# Altium schematic sheet zs-pentagon-dip_1.SchDoc
size A4
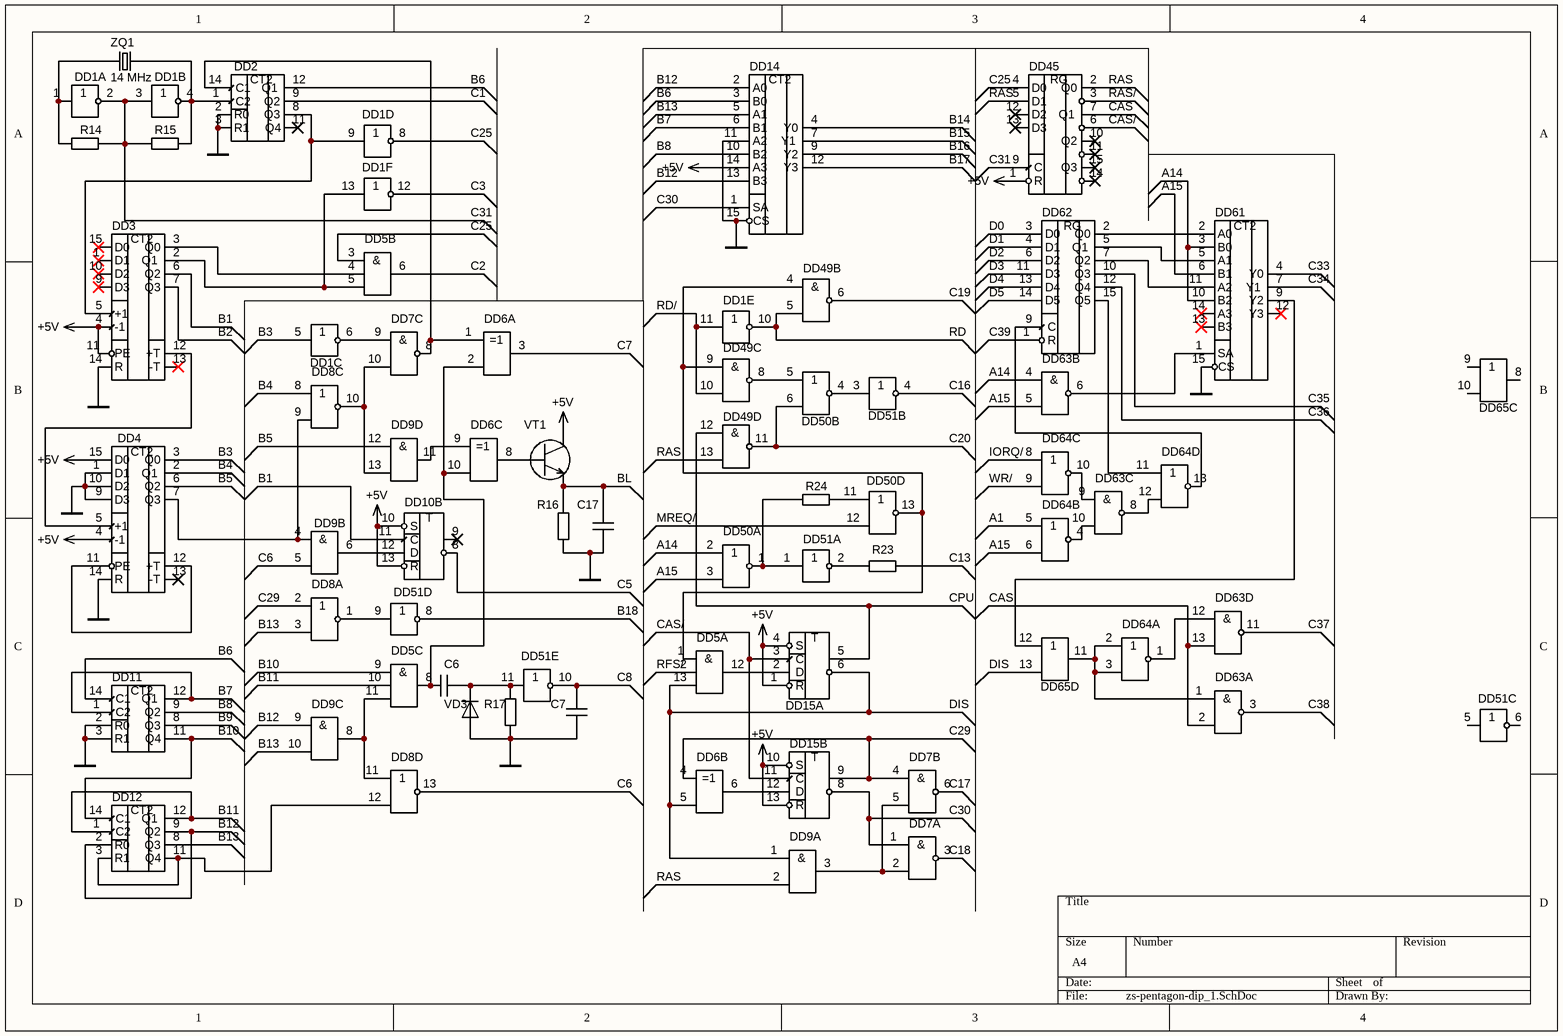
[diagram p0: zs-pentagon-dip_1.SchDoc]

## Parts
C6  0.022 мкФ  [C0805]  (value not drawn)
C7  510 пФ  [C0805]  (value not drawn)
C17  1200 пФ  [C0805]  (value not drawn)
DD1  КР1533ЛН1  [DIP14]  (value not drawn)  (parts A,B,C,D,E,F of 6)
DD2  КР1533ИЕ5  [DIP14]  (value not drawn)
DD3  КР1533ИЕ7  [DIP16]  (value not drawn)
DD4  КР1533ИЕ7  [DIP16]  (value not drawn)
DD5  КР1533ЛИ3  [DIP14]  (value not drawn)  (parts A,B,C of 3)
DD6  КР1533ЛП5  [DIP14]  (value not drawn)  (parts A,B,C of 4)
DD7  КР1533ЛA3  [DIP14]  (value not drawn)  (parts A,B,C of 4)
DD8  КР1533ЛЕ1  [DIP14]  (value not drawn)  (parts A,C,D of 4)
DD9  КР1533ЛИ1  [DIP14]  (value not drawn)  (parts A,B,C,D of 4)
DD10  КР1533ТМ2  [DIP14]  (value not drawn)  (part B of 2)
DD11  КР1533ИЕ5  [DIP14]  (value not drawn)
DD12  КР1533ИЕ5  [DIP14]  (value not drawn)
DD14  КР1533КП11А  [DIP16]  (value not drawn)
DD15  КР1533ТМ2  [DIP14]  (value not drawn)  (parts A,B of 2)
DD45  КР1533ТМ8  [DIP16]  (value not drawn)
DD49  КР1533ЛA3  [DIP14]  (value not drawn)  (parts B,C,D of 4)
DD50  КР1533ЛЕ1  [DIP14]  (value not drawn)  (parts A,B,D of 4)
DD51  КР1533ЛН1  [DIP14]  (value not drawn)  (parts A,B,C,D,E of 6)
DD61  КР1533КП11А  [DIP16]  (value not drawn)
DD62  КР1533ТМ9  [DIP16]  (value not drawn)
DD63  КР1533ЛA3  [DIP14]  (value not drawn)  (parts A,B,C,D of 4)
DD64  КР1533ЛЕ1  [DIP14]  (value not drawn)  (parts A,B,C,D of 4)
DD65  КР1533ЛЛ1  [DIP14]  (value not drawn)  (parts C,D of 4)
R14  510 Ом  [R0603]  (value not drawn)
R15  510 Ом  [R0603]  (value not drawn)
R16  160 Ом  [R0603]  (value not drawn)
R17  1 кОм  [R0603]  (value not drawn)
R23  470 Ом  [R0603]  (value not drawn)
R24  470 Ом  [R0603]  (value not drawn)
VD3  1N4148W  [SODFL1608X70N]  (value not drawn)
VT1  КТ315Б  [KT-13]  (value not drawn)
ZQ1  14 MHz  [XTAL_HC-49U]

## Nets
+5V: DD3.4(-1) DD3.11(PE) DD4.4(-1) DD4.15(D0) DD10.10(S) DD10.13(R) DD14.14(A3) DD15.1(R) DD15.4(S) DD15.10(S) DD15.13(R) DD45.1(R) VT1.2(C)
GND: C7.2 C17.1 DD1.7(GND) DD2.2(R0) DD2.3(R1) DD2.10(GND) DD3.8(GND) DD3.14(R) DD4.1(D1) DD4.8(GND) DD4.9(D3) DD4.10(D2) DD4.14(R) DD5.7(GND) DD6.7(GND) DD7.7(GND) DD8.7(GND) DD9.7(GND) DD11.2(R0) DD11.3(R1) DD11.10(GND) DD12.10(GND) DD14.8(GND) DD14.11(A2) DD14.15(CS) DD15.7(GND) DD45.8(GND) DD50.7(GND) DD51.7(GND) DD61.8(GND) DD61.15(CS) DD62.8(GND) DD63.7(GND) DD64.7(GND) R16.1 R17.1 VD3.A
VCC: DD1.14(VCC) DD2.5(VCC) DD3.16(VCC) DD4.16(VCC) DD5.14(VCC) DD6.14(VCC) DD7.14(VCC) DD8.14(VCC) DD9.14(VCC) DD11.5(VCC) DD12.5(VCC) DD14.16(VCC) DD15.14(VCC) DD45.16(VCC) DD50.14(VCC) DD51.14(VCC) DD61.16(VCC) DD62.16(VCC) DD63.14(VCC) DD64.14(VCC)
A1: DD64.5
A14: DD50.2 DD61.3(B0) DD61.10(B2) DD63.4
A15: DD50.3 DD61.6(B1) DD63.5 DD64.6
B1: DD3.6(Q2) DD10.11(C)
B2: DD3.7(Q3)
B3: DD1.5 DD4.3(Q0)
B4: DD4.2(Q1) DD8.8
B5: DD4.6(Q2) DD9.12
B6: DD2.12(Q1) DD11.14(C1) DD14.3(B0)
B7: DD11.1(C2) DD11.12(Q1) DD14.6(B1)
B8: DD11.9(Q2) DD14.10(B2)
B9: DD11.8(Q3)
B10: DD5.9 DD11.11(Q4) DD12.14(C1)
B11: DD5.10 DD12.1(C2) DD12.12(Q1)
B12: DD9.9 DD12.2(R0) DD12.9(Q2) DD14.2(A0) DD14.13(B3)
B13: DD8.3 DD9.10 DD12.8(Q3) DD14.5(A1)
B14: DD14.4(Y0)
B15: DD14.7(Y1)
B16: DD14.9(Y2)
B17: DD14.12(Y3)
B18: DD51.8
BL: C17.2 R16.2 VT1.1(E)
C1: DD2.9(Q2)
C2: DD5.6
C3: DD1.12
C5: DD10.8
C6: DD8.13 DD9.5
C7: DD6.3
C8: C7.1 DD51.10
C13: R23.1
C16: DD51.4
C17: DD7.6
C18: DD7.3
C19: DD49.6
C20: DD49.11 DD50.6
C25: DD1.8 DD5.3 DD45.4(D0)
C29: DD6.4 DD7.4 DD8.2 DD15.9
C30: DD7.1 DD14.1(SA) DD15.8
C31: DD1.2 DD1.3 DD45.9(C) R14.2 R15.1
C33: DD61.4(Y0)
C34: DD61.7(Y1)
C35: DD62.10(Q3)
C36: DD62.12(Q4)
C37: DD63.11
C38: DD63.3
C39: DD62.1(R)
CAS: DD45.7(Q1) DD63.2 DD63.13
CAS/: DD15.3(C) DD15.11(C) DD45.6
CPU: DD15.5 DD49.12
D0: DD62.3(D0)
D1: DD62.4(D1)
D2: DD62.6(D2)
D3: DD62.11(D3)
D4: DD62.13(D4)
D5: DD62.14(D5)
DIS: DD5.13 DD6.5 DD9.1 DD15.6 DD65.13
IORQ/: DD64.8
MREQ/: DD50.12
RAS: DD9.2 DD45.2(Q0) DD45.5(D1) DD49.13
RAS/: DD45.3
RD: DD1.10 DD49.5
RD/: DD1.11 DD49.10
RFS/: DD5.2
WR/: DD64.9
NetC6_1: C6.1 DD51.11 R17.2 VD3.C
NetC6_2: C6.2 DD5.8 DD6.2 DD6.10
NetDD1_1: DD1.1 R14.1 ZQ1.2
NetDD1_4: DD1.4 DD2.1(C2) R15.2 ZQ1.1
NetDD1_6: DD1.6 DD7.9
NetDD1_9: DD1.9 DD2.8(Q3) DD3.5(+1)
NetDD1_13: DD1.13 DD3.2(Q1) DD5.5
NetDD2_14: DD2.14(C1) DD6.1 DD7.8
NetDD3_3: DD3.3(Q0) DD5.4
NetDD3_12: DD3.12(+T) DD4.5(+1)
NetDD4_7: DD4.7(Q3) DD8.9 DD9.4
NetDD4_11: DD4.11(PE) DD4.12(+T)
NetDD5_1: DD5.1 DD49.4 DD49.9 DD50.13
NetDD5_11: DD5.11 DD8.11 DD9.8
NetDD5_12: DD5.12 DD15.2(D)
NetDD6_6: DD6.6 DD15.12(D)
NetDD6_8: DD6.8 VT1.3(B)
NetDD6_9: DD6.9 DD9.11
NetDD7_2: DD7.2 DD7.5 DD9.3
NetDD7_10: DD7.10 DD8.10 DD9.13
NetDD8_1: DD8.1 DD51.9
NetDD8_12: DD8.12 DD12.3(R1) DD12.11(Q4)
NetDD9_6: DD9.6 DD10.12(D)
NetDD49_8: DD49.8 DD50.5
NetDD50_1: DD50.1 DD51.1 R24.2
NetDD50_4: DD50.4 DD51.3
NetDD50_11: DD50.11 R24.1
NetDD51_2: DD51.2 R23.2
NetDD61_1: DD61.1(SA) DD63.6
NetDD61_2: DD61.2(A0) DD62.2(Q0)
NetDD61_5: DD61.5(A1) DD62.5(Q1)
NetDD61_9: DD61.9(Y2) DD65.12
NetDD61_11: DD61.11(A2) DD62.7(Q2)
NetDD62_9: DD62.9(C) DD64.13
NetDD62_15: DD62.15(Q5) DD64.11
NetDD63_1: DD63.1 DD64.2 DD64.3 DD65.11
NetDD63_8: DD63.8 DD64.12
NetDD63_9: DD63.9 DD64.10
NetDD63_10: DD63.10 DD64.4
NetDD63_12: DD63.12 DD64.1

Not connected (* = marked no-connect by the designer): DD2 11(Q4)*; DD3 1(D1)* 9(D3)* 10(D2)* 13(-T)* 15(D0)*; DD4 13(-T)*; DD10 9*; DD45 10(Q2)* 11* 12(D2)* 13(D3)* 14* 15(Q3)*; DD51 5 6; DD61 12(Y3)* 13(B3)* 14(A3)*; DD65 8 9 10

## Notes on the sheet
- (in symbol КР1533ИЕ5) CT2
- (in symbol КР1533ИЕ7) CT2
- (in symbol КР1533КП11А) CT2
- (in symbol КР1533ЛA3, part A) &
- (in symbol КР1533ЛA3, part B) &
- (in symbol КР1533ЛA3, part C) &
- (in symbol КР1533ЛA3, part D) &
- (in symbol КР1533ЛИ1, part A) &
- (in symbol КР1533ЛИ1, part B) &
- (in symbol КР1533ЛИ1, part C) &
- (in symbol КР1533ЛИ1, part D) &
- (in symbol КР1533ЛИ3, part A) &
- (in symbol КР1533ЛИ3, part B) &
- (in symbol КР1533ЛИ3, part C) &
- (in symbol КР1533ТМ2, part A) Т
- (in symbol КР1533ТМ2, part B) Т
- (in symbol КР1533ТМ8) RG
- (in symbol КР1533ТМ9) RG

## Library data of the parts
C6 C7 C17 = CapCer
R14-R17 R23 R24 = Res
VT1 = КТ315Б: NPN Transistor
ZQ1 = HC-49U_14M